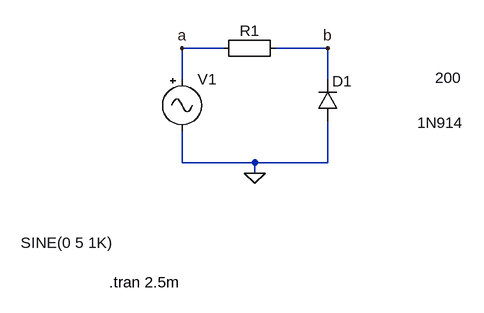
[diagram p0: schematic exp3.asc]
exp3.asc, the LTspice schematic file:
Version 4
SHEET 1 880 680
WIRE 48 -32 -16 -32
WIRE 208 -32 128 -32
WIRE -16 16 -16 -32
WIRE 208 16 208 -32
WIRE -16 144 -16 96
WIRE 96 144 -16 144
WIRE 208 144 208 80
WIRE 208 144 96 144
WIRE 96 160 96 144
FLAG -16 -32 a
FLAG 208 -32 b
FLAG 96 160 0
SYMBOL Misc\\EuropeanResistor 144 -48 R90
WINDOW 0 5 56 VBottom 2
WINDOW 3 46 -250 VTop 2
SYMATTR InstName R1
SYMATTR Value 200
SYMBOL Misc\\signal -16 0 R0
WINDOW 3 -248 267 Left 2
WINDOW 123 0 0 Left 2
WINDOW 39 0 0 Left 2
SYMATTR InstName V1
SYMATTR Value SINE(0 5 1K)
SYMBOL diode 224 80 R180
WINDOW 0 -22 61 Left 2
WINDOW 3 -193 -3 Left 2
SYMATTR InstName D1
SYMATTR Value 1N914
TEXT -128 328 Left 2 !.tran 2.5m

The netlist it stands for:
* exp3.asc
R1 b a 200
V1 a 0 SINE(0 5 1K)
D1 0 b 1N914
.model D D
.lib standard.dio
.tran 2.5m
.backanno
.end